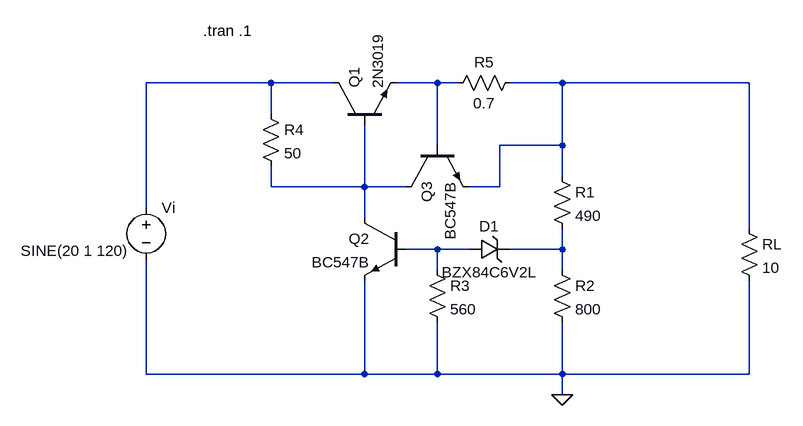
[diagram p0: schematic REGULADORES - Fonte Regulada 1.asc]
REGULADORES - Fonte Regulada 1.asc, the LTspice schematic file:
Version 4
SHEET 1 880 680
WIRE -352 -48 -544 -48
WIRE -256 -48 -352 -48
WIRE -96 -48 -160 -48
WIRE -64 -48 -96 -48
WIRE 96 -48 16 -48
WIRE 384 -48 96 -48
WIRE -352 0 -352 -48
WIRE -96 48 -96 -48
WIRE 96 48 96 -48
WIRE 96 48 0 48
WIRE 96 96 96 48
WIRE -352 112 -352 80
WIRE -208 112 -208 16
WIRE -208 112 -352 112
WIRE -144 112 -208 112
WIRE 0 112 0 48
WIRE 0 112 -48 112
WIRE -544 144 -544 -48
WIRE -208 160 -208 112
WIRE 384 176 384 -48
WIRE -96 208 -144 208
WIRE -48 208 -96 208
WIRE 96 208 96 176
WIRE 96 208 16 208
WIRE -96 240 -96 208
WIRE 96 240 96 208
WIRE -544 400 -544 224
WIRE -208 400 -208 256
WIRE -208 400 -544 400
WIRE -96 400 -96 320
WIRE -96 400 -208 400
WIRE 96 400 96 320
WIRE 96 400 -96 400
WIRE 384 400 384 256
WIRE 384 400 96 400
WIRE 96 432 96 400
FLAG 96 432 0
SYMBOL res 80 80 R0
SYMATTR InstName R1
SYMATTR Value 490
SYMBOL res 80 224 R0
SYMATTR InstName R2
SYMATTR Value 800
SYMBOL res -112 224 R0
SYMATTR InstName R3
SYMATTR Value 560
SYMBOL res -368 -16 R0
SYMATTR InstName R4
SYMATTR Value 50
SYMBOL res 368 160 R0
SYMATTR InstName RL
SYMATTR Value 10
SYMBOL zener -48 224 R270
WINDOW 0 36 32 VTop 2
WINDOW 3 -4 32 VBottom 2
SYMATTR InstName D1
SYMATTR Value BZX84C6V2L
SYMBOL npn -256 16 R270
SYMATTR InstName Q1
SYMATTR Value 2N3019
SYMBOL npn -144 160 M0
SYMATTR InstName Q2
SYMATTR Value BC547B
SYMBOL voltage -544 128 R0
WINDOW 3 -193 82 Left 2
WINDOW 123 -114 119 Left 2
WINDOW 39 0 0 Left 2
SYMATTR Value SINE(20 1 120)
SYMATTR InstName Vi
SYMBOL res 32 -64 R90
WINDOW 0 0 56 VBottom 2
WINDOW 3 32 56 VTop 2
SYMATTR InstName R5
SYMATTR Value 0.7
SYMBOL npn -144 48 M90
SYMATTR InstName Q3
SYMATTR Value BC547B
TEXT -456 -128 Left 2 !.tran .1

The netlist it stands for:
* REGULADORES - Fonte Regulada 1.asc
R1 N003 N006 490
R2 N006 0 800
R3 N005 0 560
R4 N001 N004 50
RL N003 0 10
D1 N005 N006 BZX84C6V2L
Q1 N001 N004 N002 0 2N3019
Q2 N004 N005 0 0 BC547B
Vi N001 0 SINE(20 1 120)
R5 N003 N002 0.7
Q3 N004 N002 N003 0 BC547B
.model D D
.lib standard.dio
.model NPN NPN
.model PNP PNP
.lib standard.bjt
.tran .1
.backanno
.end